# EAGLE design YOTSUBA_AP-ex_EM_ver.3.0 (EAGLE 9.6.2)
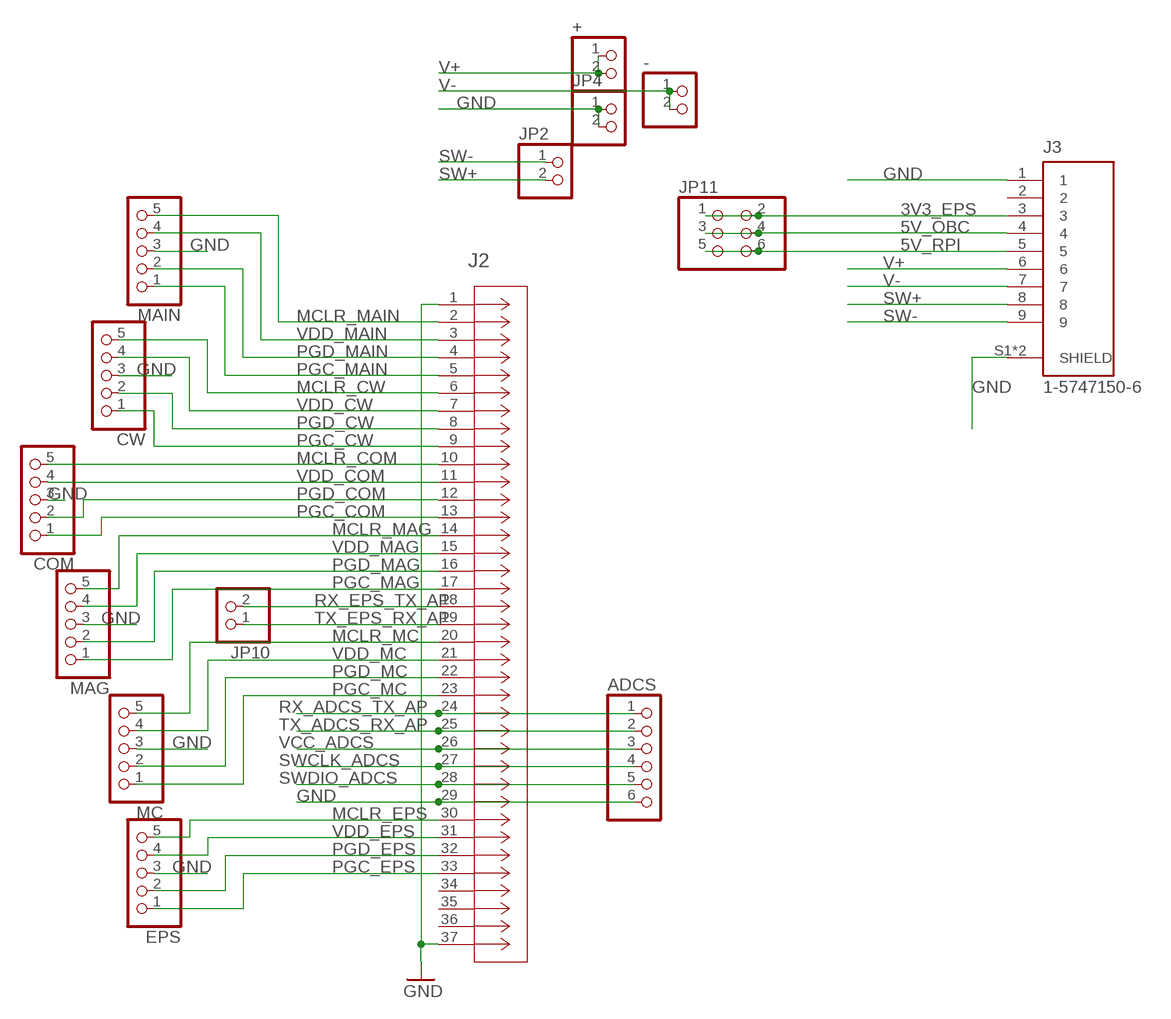
[diagram p0: schematic, sheet 1]

## Parts
+  PINHD-1X2  [1X02]
-  PINHD-1X2  [1X02]
ADCS  PINHD-1X6  [1X06]
COM  PINHD-1X5  [1X05]
CW  PINHD-1X5  [1X05]
EPS  PINHD-1X5  [1X05]
J2  1-5747301-6  [CONN_1-5747301-6_TYC]
J3  1-5747150-6  [TE_1-5747150-6]
JP2  PINHD-1X2  [1X02]
JP4  PINHD-1X2  [1X02]
JP10  PINHD-1X2  [1X02]
JP11  PINHD-2X3  [2X03]
MAG  PINHD-1X5  [1X05]
MAIN  PINHD-1X5  [1X05]
MC  PINHD-1X5  [1X05]

## Nets
3V3_EPS: J3.3 JP11.1 JP11.2
5V_OBC: J3.4 JP11.3 JP11.4
5V_RPI: J3.5 JP11.5 JP11.6
GND [gnd]: ADCS.6 COM.3 CW.3 EPS.3 J2.1 J2.29 J2.37 J3.1 J3.S1(SHIELD) J3.S2(SHIELD) JP4.1 JP4.2 MAG.3 MAIN.3 MC.3
MCLR_COM: COM.5 J2.10
MCLR_CW: CW.5 J2.6
MCLR_EPS: EPS.5 J2.30
MCLR_MAG: J2.14 MAG.5
MCLR_MAIN: J2.2 MAIN.5
MCLR_MC: J2.20 MC.5
PGC_COM: COM.1 J2.13
PGC_CW: CW.1 J2.9
PGC_EPS: EPS.1 J2.33
PGC_MAG: J2.17 MAG.1
PGC_MAIN: J2.5 MAIN.1
PGC_MC: J2.23 MC.1
PGD_COM: COM.2 J2.12
PGD_CW: CW.2 J2.8
PGD_EPS: EPS.2 J2.32
PGD_MAG: J2.16 MAG.2
PGD_MAIN: J2.4 MAIN.2
PGD_MC: J2.22 MC.2
RX_ADCS_TX_AP: ADCS.1 J2.24
RX_EPS_TX_AP: J2.18 JP10.2
SW+ [pwr]: J3.8 JP2.2
SW- [pwr]: J3.9 JP2.1
SWCLK_ADCS: ADCS.4 J2.27
SWDIO_ADCS: ADCS.5 J2.28
TX_ADCS_RX_AP: ADCS.2 J2.25
TX_EPS_RX_AP: J2.19 JP10.1
V+ [pwr]: +.1 +.2 J3.6
V- [pwr]: -.1 -.2 J3.7
VCC_ADCS: ADCS.3 J2.26
VDD_COM: COM.4 J2.11
VDD_CW: CW.4 J2.7
VDD_EPS: EPS.4 J2.31
VDD_MAG: J2.15 MAG.4
VDD_MAIN: J2.3 MAIN.4
VDD_MC: J2.21 MC.4
Unconnected: J2.34 J2.35 J2.36 J3.2

## Library data of the parts
+ - JP2 JP4 JP10 = pinhead:PINHD-1X2: PIN HEADER
ADCS = pinhead:PINHD-1X6: PIN HEADER
COM CW EPS MAG MAIN MC = pinhead:PINHD-1X5: PIN HEADER
J2 = 1-5747301-6:1-5747301-6; COPYRIGHT: Copyright (C) 2023 Ultra Librarian. All rights reserved.; MANUFACTURER_PART_NUMBER: 1-5747301-6; MFR_NAME: TE Connectivity
J3 = 1-5747150-6:1-5747150-6: 09 RCPT SP/FMS SCRLK Check availability <https://pricing.snapeda.com/parts/1-5747150-6/TE%20Connectivity/view-part?ref=eda>; AVAILABILITY: In Stock; CENTERLINE_PITCH: 2.74 mm[.108 in]; COMMENT: 1-5747150-6; DESCRIPTION: 9 Position D-Sub Receptacle, Female Sockets Connector; MF: TE Connectivity; MP: 1-5747150-6; NUMBER_OF_POSITIONS: 9; PACKAGE: None; PRICE: None; PRODUCT_TYPE: Connector; PURCHASE-URL: https://pricing.snapeda.com/search/part/1-5747150-6/?ref=eda
JP11 = pinhead:PINHD-2X3: PIN HEADER

## Net classes
0 default: clearance 0.254 mm
1 gnd: clearance 0.559 mm
2 pwr: clearance 0.229 mm
3 gnd_usb: clearance 0.025 mm

## Board
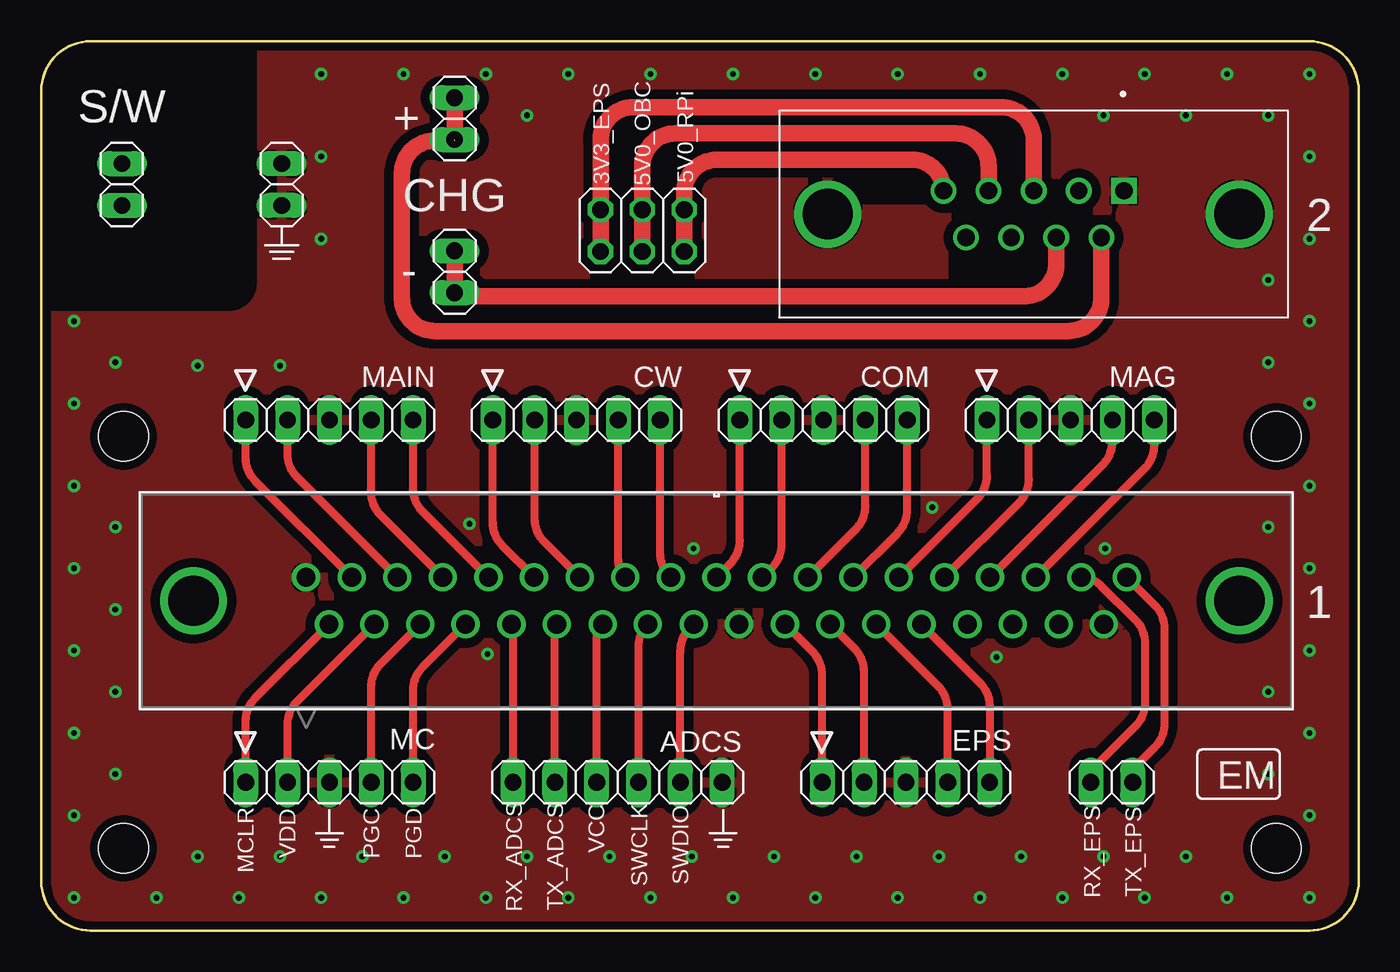
[diagram p1: board, top side]
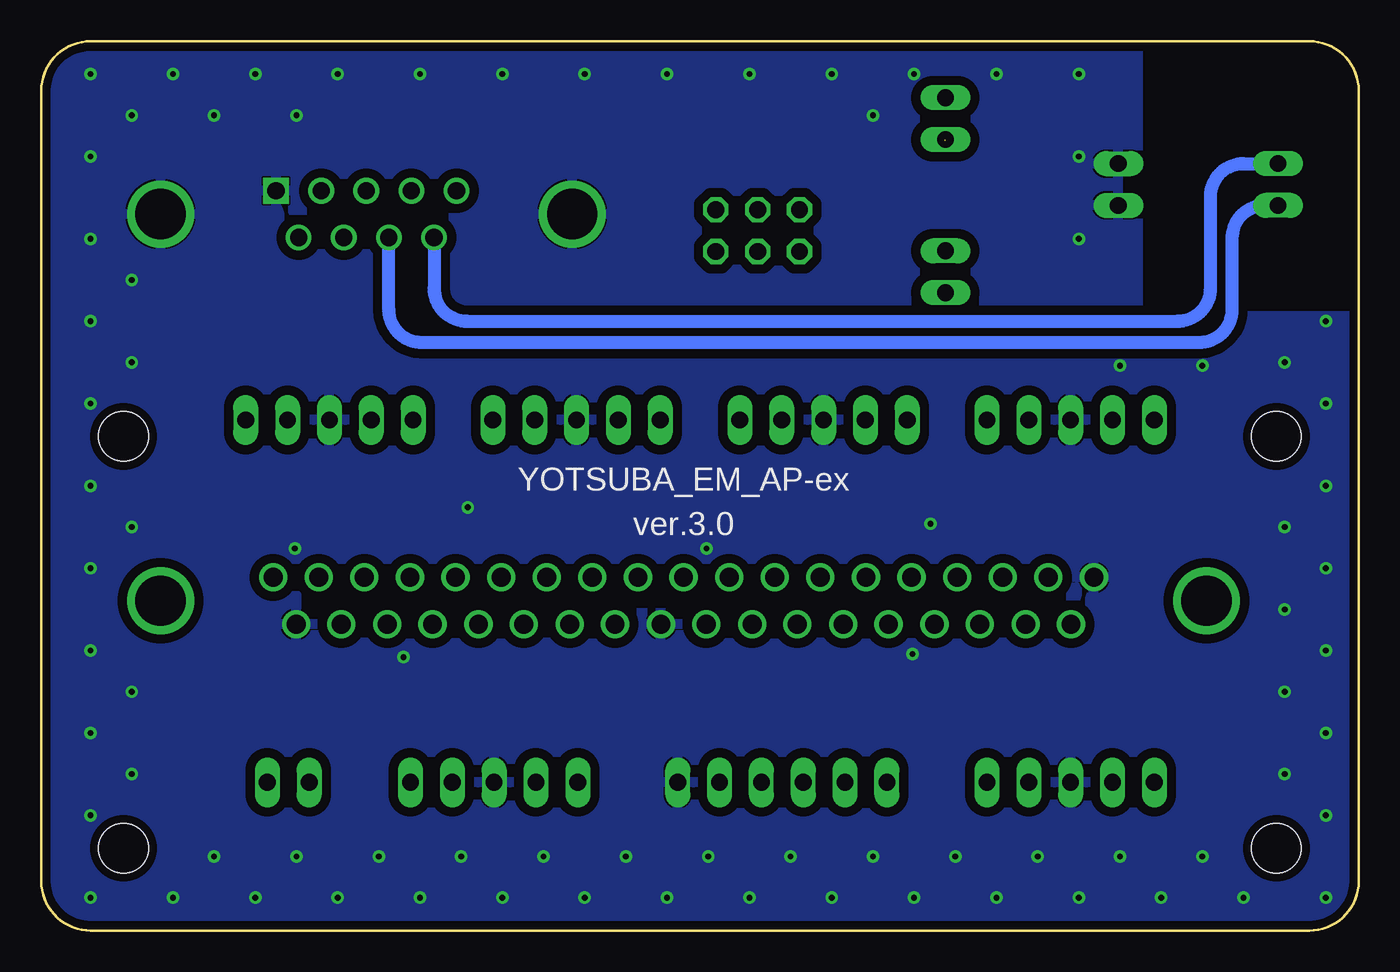
[diagram p2: board, bottom side, seen from below]

Size 80 x 54 mm. Coordinates in mm from the lower left corner, seen from the top.
Outline: 3,0 77,0 arc90 80,3 80,51 arc90 77,54 3,54 arc90 0,51 0,3 arc90 3,0
Copper layers (1*16): Top 0.035mm / dielectric 1.5mm / Bottom 0.035mm
Design rules "default *": minimum track width 6mil, minimum drill 0.35mm, track to track 6mil, track to pad 6mil, pad to pad 6mil, via to via 6mil, smd to smd 6mil, copper to edge 20mil, drill to drill 6mil, minimum pad ring 10mil, minimum via ring 8mil, stop-mask expansion 4mil, vias tented up to drill 0mil, thermal gap 4mil
Holes 3 mm at 75,30 5,30 5,5 75,5
tRestrict: 13 lines
bRestrict: 6 lines

### Footprints (pad centres in the part's own frame; a part is rotated, then mirrored left to right if it is on the bottom)
1X02 = drill 1.016 long: 1 -1.27,0; 2 1.27,0
1X06 = drill 1.016 long: 1 -6.35,0; 2 -3.81,0; 3 -1.27,0; 4 1.27,0; 5 3.81,0; 6 6.35,0
1X05 = drill 1.016 long: 1 -5.08,0; 2 -2.54,0; 3 0,0; 4 2.54,0; 5 5.08,0
CONN_1-5747301-6_TYC = drill 1.143 pad 1.651: 1 -24.917,-5.055; 2 -22.149,-5.055; 3 -19.38,-5.055; 4 -16.612,-5.055; 5 -13.843,-5.055; 6 -11.074,-5.055; 7 -8.306,-5.055; 8 -5.537,-5.055; 9 -2.769,-5.055; 10 0,-5.055; 11 2.769,-5.055; 12 5.537,-5.055; 13 8.306,-5.055; 14 11.074,-5.055; 15 13.843,-5.055; 16 16.612,-5.055; 17 19.38,-5.055; 18 22.149,-5.055; 19 24.917,-5.055; 20 -23.52,-7.899; 21 -20.777,-7.899; 22 -17.983,-7.899; 23 -15.24,-7.899; 24 -12.446,-7.899; 25 -9.703,-7.899; 26 -6.909,-7.899; 27 -4.166,-7.899; 28 -1.372,-7.899; 29 1.372,-7.899; 30 4.166,-7.899; 31 6.909,-7.899; 32 9.703,-7.899; 33 12.446,-7.899; 34 15.24,-7.899; 35 17.983,-7.899; 36 20.777,-7.899; 37 23.52,-7.899 | drill 3.048 pad 3.048: 38 -31.75,-6.477; 39 31.75,-6.477
TE_1-5747150-6 = drill 1.04 square: 1 5.485,1.42 | drill 1.04: 2 2.745,1.42; 3 0.005,1.42; 4 -2.735,1.42; 5 -5.475,1.42; 6 4.115,-1.42; 7 1.375,-1.42; 8 -1.365,-1.42; 9 -4.105,-1.42 | drill 3.05: S1 -12.495,0; S2 12.495,0
2X03 = drill 1.016 octagon: 1 -2.54,-1.27; 2 -2.54,1.27; 3 0,-1.27; 4 0,1.27; 5 2.54,-1.27; 6 2.54,1.27

### Placement (x,y rotation side)
+  25.1,49.3 270 top
-  25.1,40 270 top
ADCS  35,9 0 top
COM  47.5,31 180 top
CW  32.5,31 180 top
EPS  52.5,9 180 top
J2  41,26.5 0 top
J3  60.26,43.5 0 top
JP2  4.9,45.3 270 top
JP4  14.6,45.3 90 top
JP10  65,9 180 top
JP11  36.5,42.5 0 top
MAG  62.5,31 180 top
MAIN  17.5,31 180 top
MC  17.5,9 180 top

### Tracks (layer width: path | path; a pad name or v marks a point on that pad's centre or on a via)
3V3_EPS
  Top 1: J3.3 60.26,48 arc90 58.26,50 35.96,50 arc90 33.96,48 JP11.2 JP11.1
5V_OBC
  Top 1: JP11.3 JP11.4 36.5,46.4 arc-90 38.5,48.4 55.52,48.4 arc-90 57.52,46.4 J3.4
5V_RPI
  Top 1: J3.5 arc90 52.9,46.8 41.04,46.8 arc90 39.04,44.8 JP11.6 JP11.5
GND  (via drill 0.35)
  other vias: 2,2 2,7 2,12 2,17 2,22 2,27 2,32 7,2 12,2 17,2 22,2 27,2 32,2 37,2 42,2 47,2 52,2 57,2 62,2 67,2 72,2 77,2 77,7 77,12 77,17 77,22 77,27 77,32 77,37 77,42 77,47 77,52 72,52 67,52 62,52 57,52 52,52 47,52 42,52 37,52 32,52 27,52 22,52 2,37 17,52 17,47 17,42 4.5,34.5 4.5,19.5 4.5,24.5 4.5,14.5 4.5,9.5 9.5,4.5 14.5,4.5 19.5,4.5 24.5,4.5 29.5,4.5 34.5,4.5 39.5,4.5 44.5,4.5 49.5,4.5 54.5,4.5 59.5,4.5 64.5,4.5 69.5,4.5 74.5,9.5 74.5,14.5 74.5,24.5 74.5,34.5 74.5,39.5 74.5,49.5 69.5,49.5 64.5,49.5 29.5,49.5 9.5,34.3 14.5,34.3 26,24.7 27.1,16.8 39.6,23.2 58,16.6 54.1,25.7 64.6,23.2
  pour Top: 84.8,54 13.4,54 13.4,39.3 arc-90 11.4,37.3 -2.8,37.3 -2.8,-2.1 84.8,-2.1
  pour Bottom: 13.4,53.7 82.4,53.7 82.4,-1.5 -2.5,-1.5 -2.5,37.3 11.4,37.3 arc90 13.4,39.3
MCLR_COM
  Top 0.5: J2.10 41.83,22.28 arc45 42.42,23.69 COM.5
MCLR_CW
  Top 0.5: J2.6 28.01,23.36 arc-45 27.42,24.78 CW.5
MCLR_EPS
  Top 0.5: EPS.5 47.42,15.52 arc45 46.83,16.93 J2.30
MCLR_MAG
  Top 0.5: J2.14 56.83,26.2 arc45 57.42,27.62 MAG.5
MCLR_MAIN
  Top 0.5: J2.2 13.01,27.29 arc-45 12.42,28.71 MAIN.5
MCLR_MC
  Top 0.5: MC.5 12.42,12.71 arc-45 13.01,14.13 J2.20
PGC_COM
  Top 0.5: J2.13 51.99,24.13 arc45 52.58,25.55 COM.1
PGC_CW
  Top 0.5: J2.9 38.17,21.51 arc-45 37.58,22.93 CW.1
PGC_EPS
  Top 0.5: J2.33 56.99,15.05 arc-45 57.58,13.64 EPS.1
PGC_MAG
  Top 0.5: J2.17 66.99,28.06 arc45 67.58,29.47 MAG.1
PGC_MAIN
  Top 0.5: J2.5 23.17,25.44 arc-45 22.58,26.85 MAIN.1
PGC_MC
  Top 0.5: MC.1 22.58,14.59 arc-45 23.17,16.01 J2.23
PGD_COM
  Top 0.5: J2.12 49.45,24.36 arc45 50.04,25.78 COM.2
PGD_CW
  Top 0.5: J2.8 arc-45 35.04,22.47 CW.2
PGD_EPS
  Top 0.5: EPS.2 55.04,13.44 arc45 54.45,14.85 J2.32
PGD_MAG
  Top 0.5: J2.16 64.45,28.29 arc45 65.04,29.7 MAG.2
PGD_MAIN
  Top 0.5: J2.4 20.63,25.21 arc-45 20.04,26.62 MAIN.2
PGD_MC
  Top 0.5: MC.2 20.04,14.79 arc-45 20.63,16.21 J2.22
RX_ADCS_TX_AP
  Top 0.5: ADCS.1 28.65,18.37 arc45 J2.24
RX_EPS_TX_AP
  Top 0.5: J2.18 arc-45 64.34,20.95 66.43,18.86 arc-45 67.02,17.45 67.02,13.81 arc-45 66.43,12.4 63.73,9.7 JP10.2
SW+
  Bottom 0.8: JP2.2 5.7,44.03 arc-90 7.7,42.03 7.7,37.7 arc90 9.7,35.7 56.89,35.7 arc90 58.89,37.7 J3.8
SW-
  Bottom 0.8: J3.9 56.15,39 arc-90 54.15,37 11,37 arc-90 9,39 9,44.57 arc90 7,46.57 JP2.1
SWCLK_ADCS
  Top 0.5: ADCS.4 36.27,17.24 arc-45 J2.27
SWDIO_ADCS
  Top 0.5: ADCS.5 38.81,16.95 arc-45 39.4,18.37 J2.28
TX_ADCS_RX_AP
  Top 0.5: ADCS.2 31.19,18.34 arc-45 J2.25
TX_EPS_RX_AP
  Top 0.5: J2.19 67.61,19.75 arc-45 68.2,18.33 68.2,12.56 arc-45 67.61,11.14 66.27,9.8 JP10.1
V+  (1 unrouted)
  Top 1: J3.6 64.37,38.4 arc-90 62.37,36.4 23.9,36.4 arc-90 21.9,38.4 21.9,45.96 arc-90 23.9,47.96 25.1,47.96 | +.1 +.2
V-
  Top 1: J3.7 61.63,40.5 arc-90 59.63,38.5 26.2,38.5 25.97,38.73 -.2 -.1
VCC_ADCS
  Top 0.5: ADCS.3 33.73,17.73 arc-45 J2.26
VDD_COM
  Top 0.5: J2.11 44.37,22.05 arc45 44.96,23.46 COM.4
VDD_CW
  Top 0.5: J2.7 30.55,23.59 arc-45 29.96,25.01 CW.4
VDD_EPS
  Top 0.5: EPS.4 49.96,15.72 arc45 49.37,17.14 J2.31
VDD_MAG
  Top 0.5: J2.15 59.37,25.98 arc45 59.96,27.39 MAG.4
VDD_MAIN
  Top 0.5: J2.3 15.55,27.52 arc-45 14.96,28.93 MAIN.4
VDD_MC
  Top 0.5: MC.4 14.96,12.51 arc-45 15.55,13.92 J2.21

### Text on the board
tPlace: 3V3_EPS | 5V0_OBC | 5V0_RPi
tNames: S/W | CHG | 2 | 1 | EM | MCLR | VDD | PGC | PGD | VCC | SWCLK | SWDIO | RX_EPS | TX_EPS | RX_ADCS | TX_ADCS
bNames: YOTSUBA_EM_AP-ex | ver.3.0